# EasyEDA Pro project ique_xbox_flex_r0.epro

# Schematic Schematic1
Board Name: Board1; Create Date: 2025-11-02; Page Name: P1; Project Name: iQue_connector_flex; Schematic Name: Schematic1; Update Date: 2025-11-02; Company: EasyEDA.com; Page Size: A4; Version: V1.0
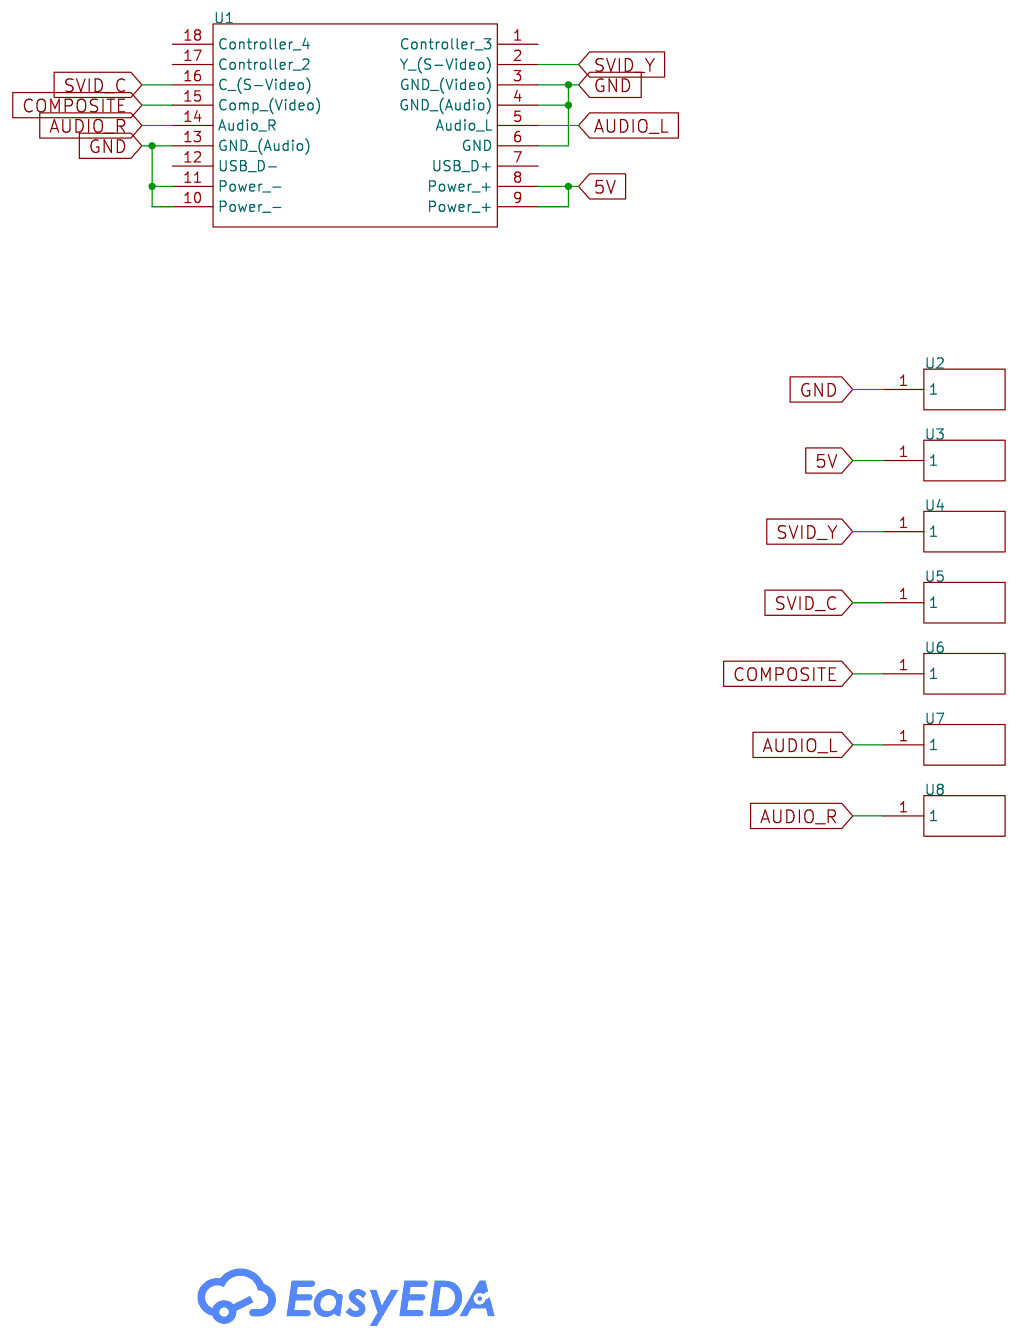
[diagram p0: schematic sheet]

## Parts
U1  -  [iQue_Connector_Flex]
U2  -  [sqpad_3mm]
U3  -  [sqpad_3mm]
U4  -  [sqpad_3mm]
U5  -  [sqpad_3mm]
U6  -  [sqpad_3mm]
U7  -  [sqpad_3mm]
U8  -  [sqpad_3mm]

## Library data of the parts
U1 = ique_connector_flex
U2-U8 = sqpad_3mm

## Nets
5V: U1.8(Power +) U1.9(Power +) U3.1
GND: U1.3(GND (Video)) U1.4(GND (Audio)) U1.6(GND) U1.10(Power -) U1.11(Power -) U1.13(GND (Audio)) U2.1
AUDIO_L: U1.5(Audio L) U7.1
AUDIO_R: U1.14(Audio R) U8.1
COMPOSITE: U1.15(Comp (Video)) U6.1
SVID_C: U1.16(C (S-Video)) U5.1
SVID_Y: U1.2(Y (S-Video)) U4.1

Not connected (* = marked no-connect by the designer): U1 1(Controller 3) 7(USB D+) 12(USB D-) 17(Controller 2) 18(Controller 4)

# Board PCB1
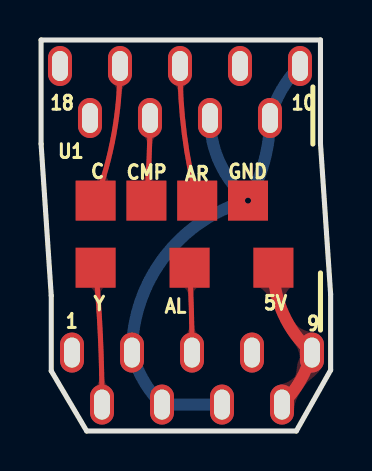
[diagram p1: board, top side]
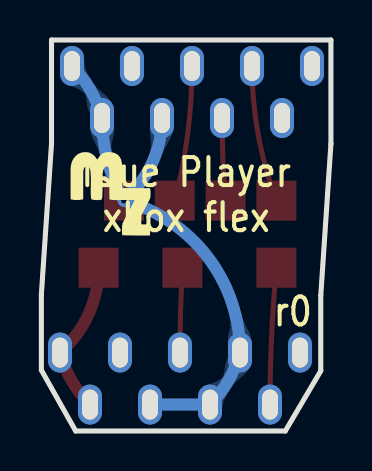
[diagram p2: board, bottom side, seen from below]

Outline 14.48 x 19.56 mm; copper layers: Top Layer, Bottom Layer. Coordinates in mm from the lower left corner of the outline.
Outline path: 0,19.56 0,14.36 0.51,6.77 0.51,3.01 2.28,0 12.76,0 14.48,3.05 14.48,6.84 13.97,14.38 13.97,19.56 0,19.56
Stack: Top Layer 0.035mm / Dielectric1 1.51mm FR4 er 4.5 / Bottom Layer 0.035mm

## Design rules (mm)
template: JLCPCB Capability(Two Layers Board)
spacing copperThickness1oz (default): track to track 0.102, other pairs 0.152 to 0.3
spacing copperThickness2oz: track to track 0.203, other pairs 0.152 to 0.3
track width copperThickness1oz (default): min 0.127, default 0.254, max 2.54
track width copperThickness2oz: min 0.203, default 0.254, max 2.54
differential pair differentialPair (default): width min 0.127, default 0.254, max 2.54; gap min 0.152, default 0.152
via viaSize (default): diameter min 0.5, default 0.61, max 10; hole min 0.3, default 0.305, max 6.3

## Placement (name value [footprint] x y rotation side)
5V  -  [sqpad_3mm]  11.62 8.17 0 top
AL  -  [sqpad_3mm]  7.43 8.17 0 top
AR  -  [sqpad_3mm]  7.81 11.52 0 top
C  -  [sqpad_3mm]  2.73 11.52 0 top
CMP  -  [sqpad_3mm]  5.27 11.52 0 top
GND  -  [sqpad_3mm]  10.35 11.52 0 top
U1  -  [iQue_Connector_Flex]  10.69 9.62 0 top
Y  -  [sqpad_3mm]  2.73 8.17 0 top

## Footprints (pads in the part's own frame, mm; a bottom-side part is the same pattern mirrored in y, then rotated)
iQue_Connector_Flex
  oval 1.2x2 hole 0.8x1.5: 1(-9.146,-5.7) 2(-7.646,-8.3) 3(-6.146,-5.699) 4(-4.646,-8.3) 5(-3.146,-5.699) 6(-1.646,-8.3) 7(-0.146,-5.699) 8(1.354,-8.3) 9(2.854,-5.699) 10(2.253,8.633) 11(0.753,6.032) 12(-0.747,8.633) 13(-2.247,6.032) 14(-3.747,8.633) 15(-5.247,6.032) 16(-6.747,8.633) 17(-8.246,6.032) 18(-9.746,8.633)
sqpad_3mm
  rect 2x2 smd: 1(0,0)

## Nets
5V: 5V.1 U1.8 U1.9
GND: GND.1 U1.3 U1.4 U1.6 U1.10 U1.11 U1.13
AUDIO_L: AL.1 U1.5
AUDIO_R: AR.1 U1.14
COMPOSITE: CMP.1 U1.15
SVID_C: C.1 U1.16
SVID_Y: U1.2 Y.1

Pads without a net: U1 1 7 12 17 18

## Via types
v1: diameter 0.61, hole 0.305, Top Layer to Bottom Layer, 1 via

## Routing (per net, layer and track width the routed paths; a pad name or vN(x,y) marks a point on that pad's centre or on a via; arc(x,y) is an arc through that point)
5V: length 7.8
  Top Layer w0.6: 5V.1 arc(12.12,5.84) U1.9 arc(12.97,2.53) U1.8
GND: length 28.3
  Bottom Layer w0.6: U1.6 U1.4 arc(5.12,2.53) U1.3 arc(6.16,8.7) v1(10.35,11.52) ; U1.10 arc(12.02,17.06) U1.11 arc(11.17,13.53) 10.36,11.55 arc(8.95,13.39) U1.13
AUDIO_L: length 4.2
  Top Layer w0.254: U1.5 arc(7.52,6.05) AL.1
AUDIO_R: length 6.8
  Top Layer w0.254: U1.14 arc(7.16,14.86) AR.1
COMPOSITE: length 4.1
  Top Layer w0.254: U1.15 arc(5.4,13.59) CMP.1
SVID_C: length 6.9
  Top Layer w0.254: U1.16 arc(3.64,14.84) C.1
SVID_Y: length 6.9
  Top Layer w0.254: U1.2 arc(2.97,4.75) Y.1

## Copper pours and planes (outline as drawn; the poured copper is in the pictures)
GND on Top Layer: 0,19.56 14.48,19.56 14.48,0 0,0
GND on Bottom Layer: 0,19.56 14.48,19.56 14.48,0 0,0

Small or netless copper shapes (teardrops, artwork), in the pictures only: 14 on Top Layer, 12 on Bottom Layer

## Text on the board
Bottom Silkscreen Layer: iQue Player / xbox flex | r0
Top Silkscreen Layer: 18 | 1 | 10 | 9
